# EAGLE schematic TSAL (EAGLE 7.5.0)
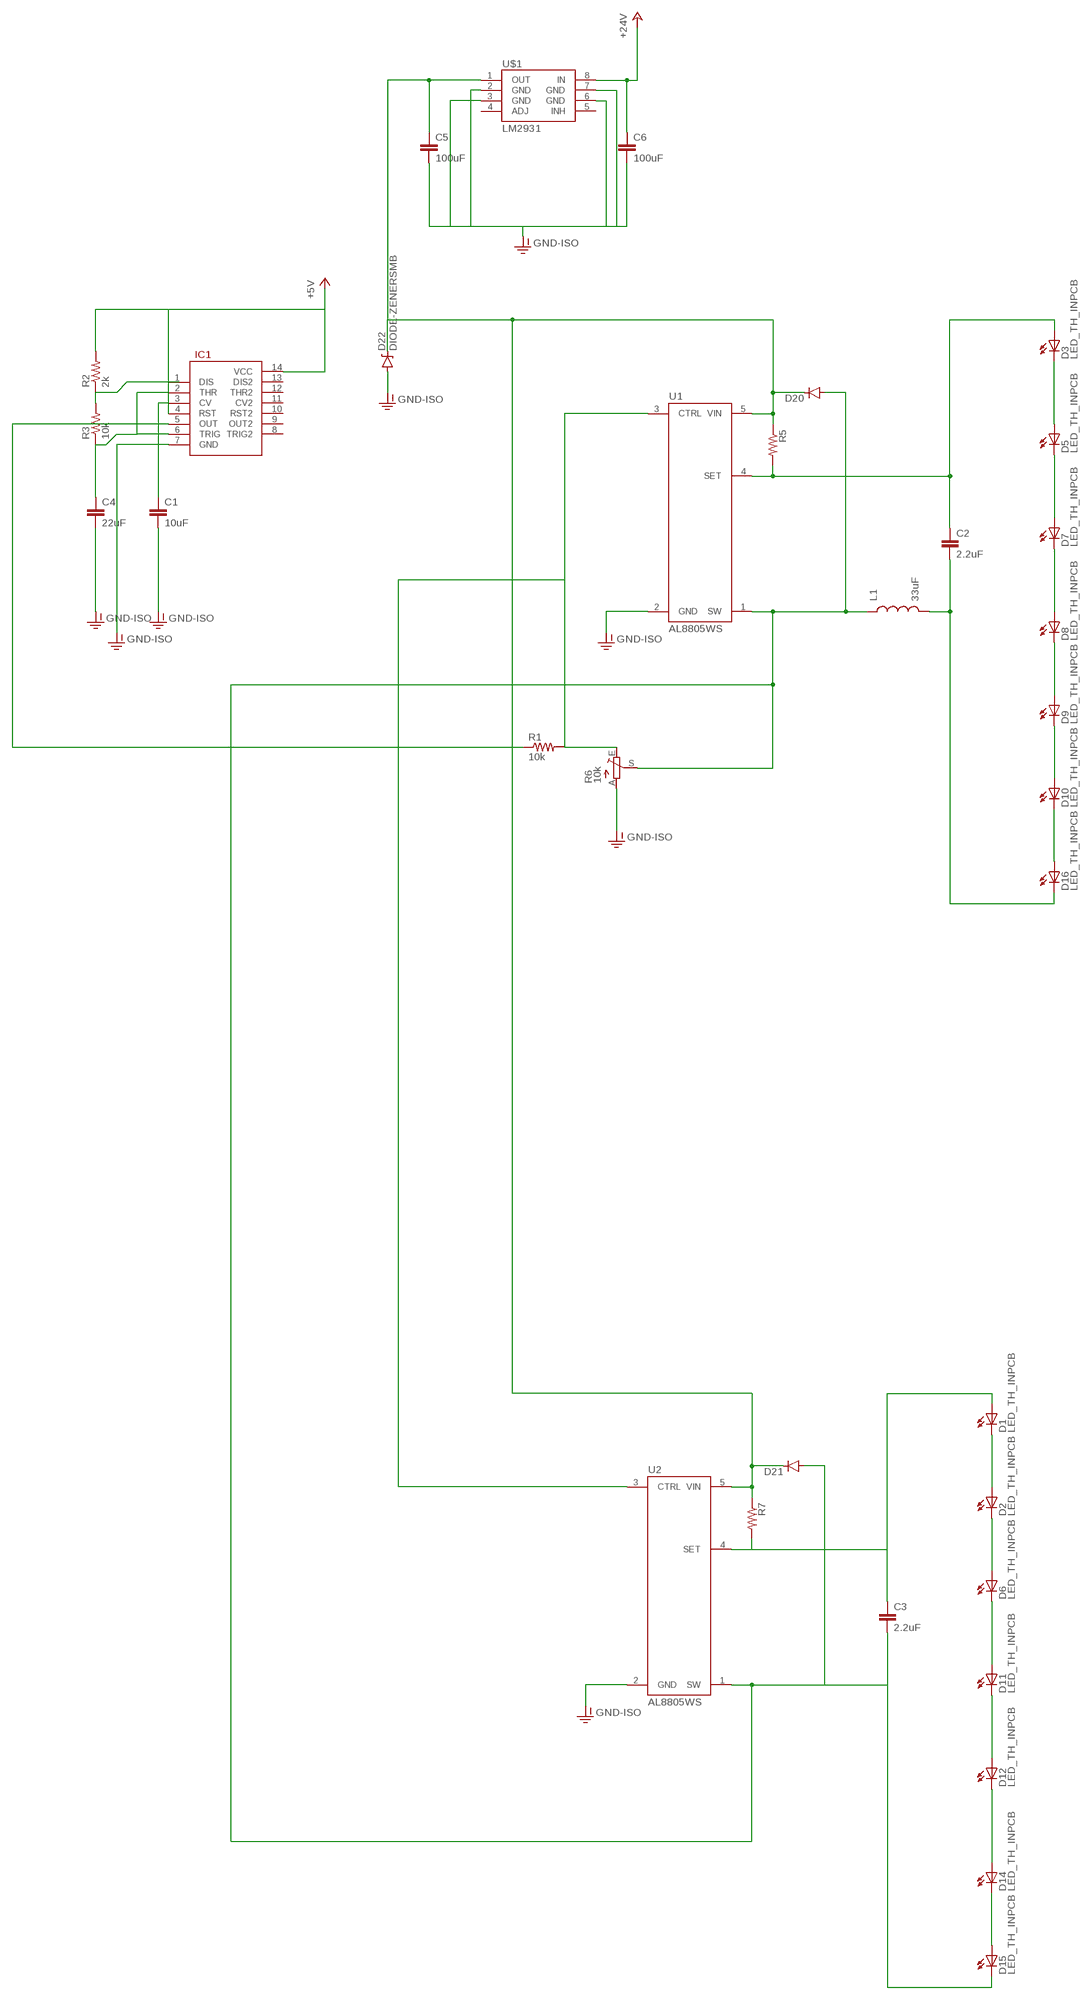
[diagram p0: schematic, sheet 1]

## Parts
C1  10uF  CAP0805  [0805]
C2  2.2uF  CAP0805  [0805]
C3  2.2uF  CAP0805  [0805]
C4  22uF  CAP0805  [0805]
C5  100uF  CAP0805  [0805]
C6  100uF  CAP0805  [0805]
D1  LED_TH_INPCB  [5MM_TH_INDENT]
D2  LED_TH_INPCB  [5MM_TH_INDENT]
D3  LED_TH_INPCB  [5MM_TH_INDENT]
D5  LED_TH_INPCB  [5MM_TH_INDENT]
D6  LED_TH_INPCB  [5MM_TH_INDENT]
D7  LED_TH_INPCB  [5MM_TH_INDENT]
D8  LED_TH_INPCB  [5MM_TH_INDENT]
D9  LED_TH_INPCB  [5MM_TH_INDENT]
D10  LED_TH_INPCB  [5MM_TH_INDENT]
D11  LED_TH_INPCB  [5MM_TH_INDENT]
D12  LED_TH_INPCB  [5MM_TH_INDENT]
D14  LED_TH_INPCB  [5MM_TH_INDENT]
D15  LED_TH_INPCB  [5MM_TH_INDENT]
D16  LED_TH_INPCB  [5MM_TH_INDENT]
D20  DIODESMB  [SMB-DIODE]
D21  DIODESMB  [SMB-DIODE]
D22  DIODE-ZENERSMB  [SMB-DIODE]
IC1  556  [DIL14]
L1  33uF  INDUCTOR0805  [0805]
R1  10k  RESISTOR0805-RES  [0805]
R2  2k  RESISTOR0805-RES  [0805]
R3  10k  RESISTOR0805-RES  [0805]
R5  RESISTOR0805-RES  [0805]
R6  10k  TRIM_EU-B25P  [B25P]
R7  RESISTOR0805-RES  [0805]
U1  AL8805WS  AL8805  [SOT23-5]
U2  AL8805WS  AL8805  [SOT23-5]
U$1  LM2931  [SO08]

## Nets
+5V: IC1.4(RST) IC1.14(VCC) R2.2
+24V: C6.1 U$1.8(IN)
GND-ISO: C1.2 C4.2 C5.2 C6.2 D22.A IC1.7(GND) R6.A U1.2(GND) U2.2(GND) U$1.2(GND) U$1.3(GND) U$1.6(GND) U$1.7(GND)
N$1: C3.1 D1.A R7.2 U2.4(SET)
N$2: IC1.5(OUT) R1.1
N$3: D14.C D15.A
N$4: C1.1 IC1.3(CV)
N$5: R2.1 R3.2
N$6: D12.C D14.A
N$7: C3.2 D15.C D20.A D21.A L1.1 R6.S U1.1(SW) U2.1(SW)
N$8: D3.C D5.A
N$10: C4.1 IC1.2(THR) IC1.6(TRIG) R3.1
N$11: D11.C D12.A
N$12: D6.C D11.A
N$13: D2.C D6.A
N$14: R1.2 R6.E U1.3(CTRL) U2.3(CTRL)
N$15: D1.C D2.A
N$16: C2.1 D3.A R5.2 U1.4(SET)
N$18: D10.C D16.A
N$19: C2.2 D16.C L1.2
N$20: D9.C D10.A
N$21: D8.C D9.A
N$22: D7.C D8.A
N$23: D5.C D7.A
N$35: C5.1 D20.C D21.C D22.C R5.1 R7.1 U1.5(VIN) U2.5(VIN) U$1.1(OUT)
Unconnected: IC1.1(DIS) IC1.8(TRIG2) IC1.9(OUT2) IC1.10(RST2) IC1.11(CV2) IC1.12(THR2) IC1.13(DIS2) U$1.4(ADJ) U$1.5(INH)

## Library data of the parts
C1-C6 = SparkFun-Capacitors:CAP: Capacitor Standard 0603 ceramic capacitor, and 0.1" leaded capacitor.
D1-D3 D5-D12 D14-D16 = FSAE Electric:LED
D20 D21 = SparkFun-DiscreteSemi:DIODE: Diode These are standard reverse protection diodes and small signal diodes. SMA package can handle up to about 1A. SOD-323 can handle about 200mA. What the SOD-323 package when ordering, there are some mfgs out there that are 5-pin packages.; PROD_ID: DIO-09646
D22 = SparkFun-DiscreteSemi:DIODE-ZENER: Zener Diode Production Part - 8199 3.4V Zener Voltage
IC1 = SparkFun-AnalogIC:556: Dual timer circuit (2 555 timers in one package)
L1 = SparkFun-Passives:INDUCTOR: Inductors Basic Inductor/Choke - 0603 and 1206. Footprints are not proven and vary greatly between part numbers. SRN6045- 33uH, 20% 1.4A SDR0403-560KL - 56uH, 10%, 500mA RMS/740mA peak
R1-R3 R5 R7 = SparkFun-Passives:RESISTOR: Resistor Basic schematic elements and footprints for 0603, 1206, and PTH resistors.
R6 = pot:TRIM_EU-: POTENTIOMETER
U1 U2 = SparkFun-PowerIC:AL8805: Constant current LED driver PWM-able 1MHz switch freq 6V-36V Up to 1A LED current; PROD_ID: IC-11626
U$1 = SparkFun-PowerIC:LM2931: LDO regulator with reverse battery protection- very durable!